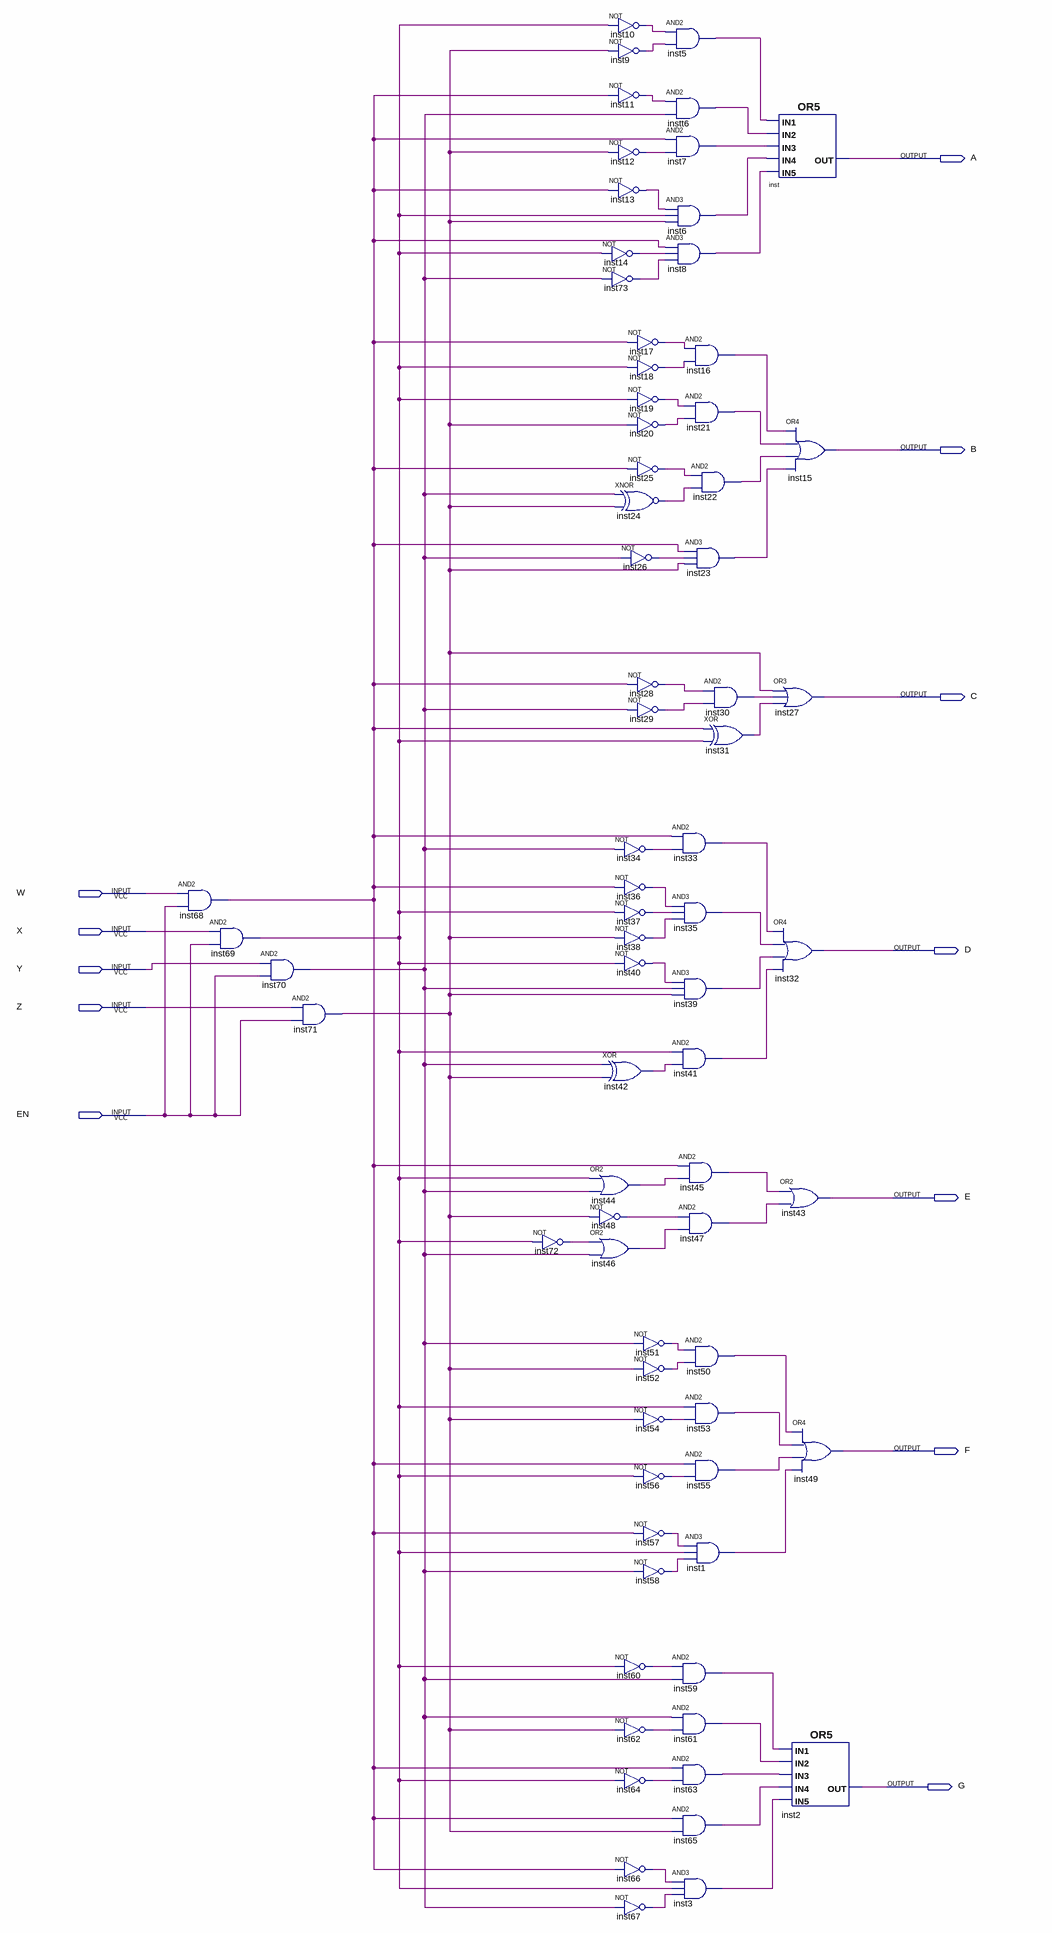
[diagram p0: schematic sheet]
// Quartus schematic bcd7seg.bdf as structural Verilog: 74 symbols, 12 pins
module bcd7seg (
  input  W,
  input  X,
  input  Y,
  input  Z,
  input  EN,
  output A,
  output B,
  output C,
  output D,
  output E,
  output F,
  output G
);

  wire inst1_out, inst3_out, inst5_out, inst6_out, inst7_out, inst8_out, inst9_out, inst10_out, inst11_out,
       inst12_out, inst13_out, inst14_out, inst16_out, inst17_out, inst18_out, inst19_out, inst20_out,
       inst21_out, inst22_out, inst23_out, inst24_out, inst25_out, inst26_out, inst28_out, inst29_out,
       inst30_out, inst31_out, inst33_out, inst34_out, inst35_out, inst36_out, inst37_out, inst38_out,
       inst39_out, inst40_out, inst41_out, inst42_out, inst44_out, inst45_out, inst46_out, inst47_out,
       inst48_out, inst50_out, inst51_out, inst52_out, inst53_out, inst54_out, inst55_out, inst56_out,
       inst57_out, inst58_out, inst59_out, inst60_out, inst61_out, inst62_out, inst63_out, inst64_out,
       inst65_out, inst66_out, inst67_out, inst68_out, inst69_out, inst70_out, inst71_out, inst72_out,
       inst73_out, instt6_out;

  and inst68 (inst68_out, W, EN);
  and inst69 (inst69_out, X, EN);
  and inst70 (inst70_out, Y, EN);
  and inst71 (inst71_out, Z, EN);
  not inst72 (inst72_out, inst69_out);
  or inst44 (inst44_out, inst69_out, inst70_out);
  not inst48 (inst48_out, inst71_out);
  or inst46 (inst46_out, inst72_out, inst70_out);
  not inst10 (inst10_out, inst69_out);
  not inst9 (inst9_out, inst71_out);
  not inst11 (inst11_out, inst68_out);
  not inst12 (inst12_out, inst71_out);
  not inst13 (inst13_out, inst68_out);
  not inst14 (inst14_out, inst69_out);
  not inst73 (inst73_out, inst70_out);
  not inst17 (inst17_out, inst68_out);
  not inst18 (inst18_out, inst69_out);
  not inst19 (inst19_out, inst69_out);
  not inst20 (inst20_out, inst71_out);
  not inst25 (inst25_out, inst68_out);
  xnor inst24 (inst24_out, inst70_out, inst71_out);
  not inst26 (inst26_out, inst70_out);
  not inst28 (inst28_out, inst68_out);
  not inst29 (inst29_out, inst70_out);
  not inst34 (inst34_out, inst70_out);
  not inst36 (inst36_out, inst68_out);
  not inst37 (inst37_out, inst69_out);
  not inst38 (inst38_out, inst71_out);
  not inst40 (inst40_out, inst69_out);
  xor inst42 (inst42_out, inst70_out, inst71_out);
  not inst51 (inst51_out, inst70_out);
  not inst52 (inst52_out, inst71_out);
  not inst54 (inst54_out, inst71_out);
  not inst56 (inst56_out, inst69_out);
  not inst57 (inst57_out, inst68_out);
  not inst58 (inst58_out, inst70_out);
  not inst60 (inst60_out, inst69_out);
  not inst62 (inst62_out, inst71_out);
  not inst64 (inst64_out, inst69_out);
  not inst66 (inst66_out, inst68_out);
  not inst67 (inst67_out, inst70_out);
  and inst5 (inst5_out, inst10_out, inst9_out);
  and instt6 (instt6_out, inst11_out, inst70_out);
  and inst7 (inst7_out, inst68_out, inst12_out);
  and inst6 (inst6_out, inst13_out, inst69_out, inst71_out);
  and inst8 (inst8_out, inst68_out, inst14_out, inst73_out);
  and inst16 (inst16_out, inst17_out, inst18_out);
  and inst21 (inst21_out, inst19_out, inst20_out);
  and inst22 (inst22_out, inst25_out, inst24_out);
  and inst23 (inst23_out, inst68_out, inst26_out, inst71_out);
  and inst33 (inst33_out, inst68_out, inst34_out);
  and inst35 (inst35_out, inst36_out, inst37_out, inst38_out);
  and inst39 (inst39_out, inst40_out, inst70_out, inst71_out);
  and inst41 (inst41_out, inst69_out, inst42_out);
  and inst45 (inst45_out, inst68_out, inst44_out);
  and inst47 (inst47_out, inst48_out, inst46_out);
  and inst50 (inst50_out, inst51_out, inst52_out);
  and inst53 (inst53_out, inst69_out, inst54_out);
  and inst55 (inst55_out, inst68_out, inst56_out);
  and inst1 (inst1_out, inst57_out, inst69_out, inst58_out);
  and inst59 (inst59_out, inst60_out, inst70_out);
  and inst61 (inst61_out, inst70_out, inst62_out);
  and inst63 (inst63_out, inst68_out, inst64_out);
  and inst65 (inst65_out, inst68_out, inst71_out);
  and inst3 (inst3_out, inst66_out, inst69_out, inst67_out);
  and inst30 (inst30_out, inst28_out, inst29_out);
  xor inst31 (inst31_out, inst68_out, inst69_out);
  or inst (A, inst5_out, instt6_out, inst7_out, inst6_out, inst8_out);
  or inst15 (B, inst16_out, inst21_out, inst22_out, inst23_out);
  or inst27 (C, inst71_out, inst30_out, inst31_out);
  or inst32 (D, inst33_out, inst35_out, inst39_out, inst41_out);
  or inst43 (E, inst45_out, inst47_out);
  or inst49 (F, inst50_out, inst53_out, inst55_out, inst1_out);
  or inst2 (G, inst59_out, inst61_out, inst63_out, inst65_out, inst3_out);
endmodule
